# Altium schematic sheet USB_ISOLATE.SchDoc
size A; SheetNumber: 8; SheetTotal: 21
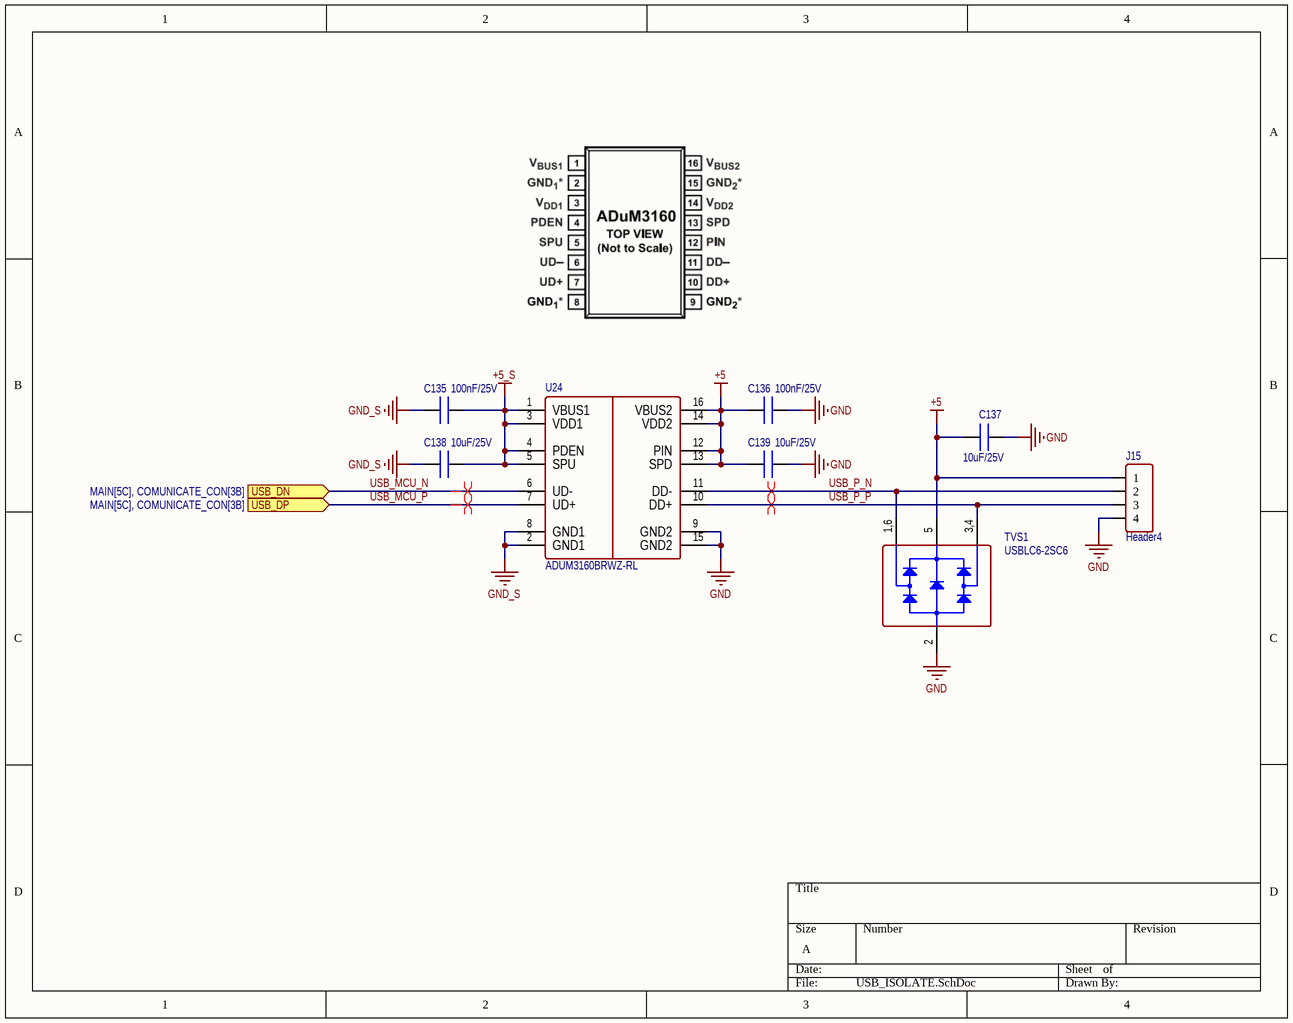
[diagram p0: USB_ISOLATE.SchDoc]

## Parts
C135  100nF/25V  [CN-SMD-0603]
C136  100nF/25V  [CN-SMD-0603]
C137  10uF/25V  [CN-SMD-0603]
C138  10uF/25V  [CN-SMD-0603]
C139  10uF/25V  [CN-SMD-0603]
J15  Header4  [XH2.54-4-DIP]
TVS1  USBLC6-2SC6  [SOT23-6]
U24  ADUM3160BRWZ-RL  [SO16L]

## Ports
USB_DN (in, see MAIN[5C], COMUNICATE_CON[3B]), USB_DP (in, see MAIN[5C], COMUNICATE_CON[3B])

## Nets
+5: C136.2 C137.2 C139.2 J15.1 TVS1.5 U24.12(PIN) U24.13(SPD) U24.14(VDD2) U24.16(VBUS2)
+5_S: C135.1 C138.1 U24.1(VBUS1) U24.3(VDD1) U24.4(PDEN) U24.5(SPU)
GND: C136.1 C137.1 C139.1 J15.4 TVS1.2 U24.9(GND2) U24.15(GND2)
GND_S: C135.2 C138.2 U24.2(GND1) U24.8(GND1)
USB_MCU_N: U24.6(UD-) ; port USB_DN
USB_MCU_P: U24.7(UD+) ; port USB_DP
USB_P_N: J15.2 TVS1.1,6(IO1) U24.11(DD-)
USB_P_P: J15.3 TVS1.3,4(IO2) U24.10(DD+)

## Layout directives
differential pair; differential pair class USB: USB_P_N, USB_P_P
differential pair: USB_MCU_N, USB_MCU_P

## Library data of the parts
C135 C136 = CN: CL10B104KA8NNNC; PN: CL10B104KA8NNNC
C137-C139 = CN: 0603W106M250XD; PN: 0603W106M250XD
J15 = Header4: Connector 4; Manufacturer: W¨¹rth Elektronik eiSos GmbH; partNo: 613002143121; ComponentLink1 Description: Manufacturer; ComponentLink2 Description: Datasheet; NoPins: 02; Created Date: 29 March 2013; ComponentLink1URL: http://www.we-online.com; ComponentLink2URL: http://katalog.we-online.de/em/datasheet/6130xx143121.pdf; Created by: Karrer Zheng
TVS1 = USBLC6-2: PN: USBLC6-2SC6
U24 = ADUM3160: Full/Low Speed 2.5 kV USB Digital Isolator; PN: ADUM3160BRWZ-RL